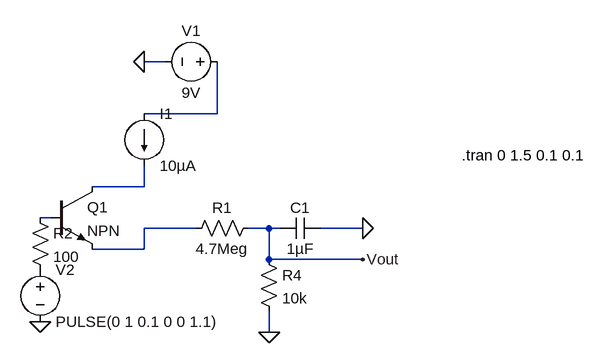
[diagram p0: schematic Draft3.asc]
Draft3.asc, the LTspice schematic file:
Version 4.1
SHEET 1 880 680
WIRE -32 -256 -64 -256
WIRE 48 -176 48 -256
WIRE 48 -176 -64 -176
WIRE -64 -64 -64 -96
WIRE -64 -64 -144 -64
WIRE -208 -16 -224 -16
WIRE 16 0 -64 0
WIRE 128 0 96 0
WIRE 144 0 128 0
WIRE 272 0 208 0
WIRE -64 32 -64 0
WIRE -64 32 -144 32
WIRE 128 48 128 0
WIRE 272 48 128 48
WIRE 128 160 128 128
FLAG -64 -256 0
FLAG 272 0 0
FLAG -224 144 0
FLAG 128 160 0
FLAG 272 48 Vout
SYMBOL cap 208 -16 R90
WINDOW 0 0 32 VBottom 2
WINDOW 3 32 32 VTop 2
SYMATTR InstName C1
SYMATTR Value 1µF
SYMBOL voltage 64 -256 R90
WINDOW 0 -32 56 VBottom 2
WINDOW 3 32 56 VTop 2
SYMATTR InstName V1
SYMATTR Value 9V
SYMBOL res 112 -16 R90
WINDOW 0 0 56 VBottom 2
WINDOW 3 32 56 VTop 2
SYMATTR InstName R1
SYMATTR Value 4.7Meg
SYMBOL current -64 -176 R0
WINDOW 123 0 0 Left 0
WINDOW 39 0 0 Left 0
SYMATTR InstName I1
SYMATTR Value 10µA
SYMBOL npn -208 -64 R0
SYMATTR InstName Q1
SYMBOL voltage -224 48 R0
WINDOW 123 0 0 Left 0
WINDOW 39 0 0 Left 0
SYMATTR InstName V2
SYMATTR Value PULSE(0 1 0.1 0 0 1.1)
SYMBOL res -240 -32 R0
SYMATTR InstName R2
SYMATTR Value 100
SYMBOL res 112 32 R0
SYMATTR InstName R4
SYMATTR Value 10k
TEXT 424 -112 Left 2 !.tran 0 1.5 0.1 0.1

The netlist it stands for:
* Draft3.asc
C1 0 Vout 1µF
V1 N001 0 9V
R1 Vout N004 4.7Meg
I1 N001 N002 10µA
Q1 N002 N003 N004 0 NPN
V2 P001 0 PULSE(0 1 0.1 0 0 1.1)
R2 N003 P001 100
R4 Vout 0 10k
.model NPN NPN
.model PNP PNP
.lib standard.bjt
.tran 0 1.5 0.1 0.1
.backanno
.end